# Altium schematic sheet USB_UART.schdoc
size 223 x 199 mm
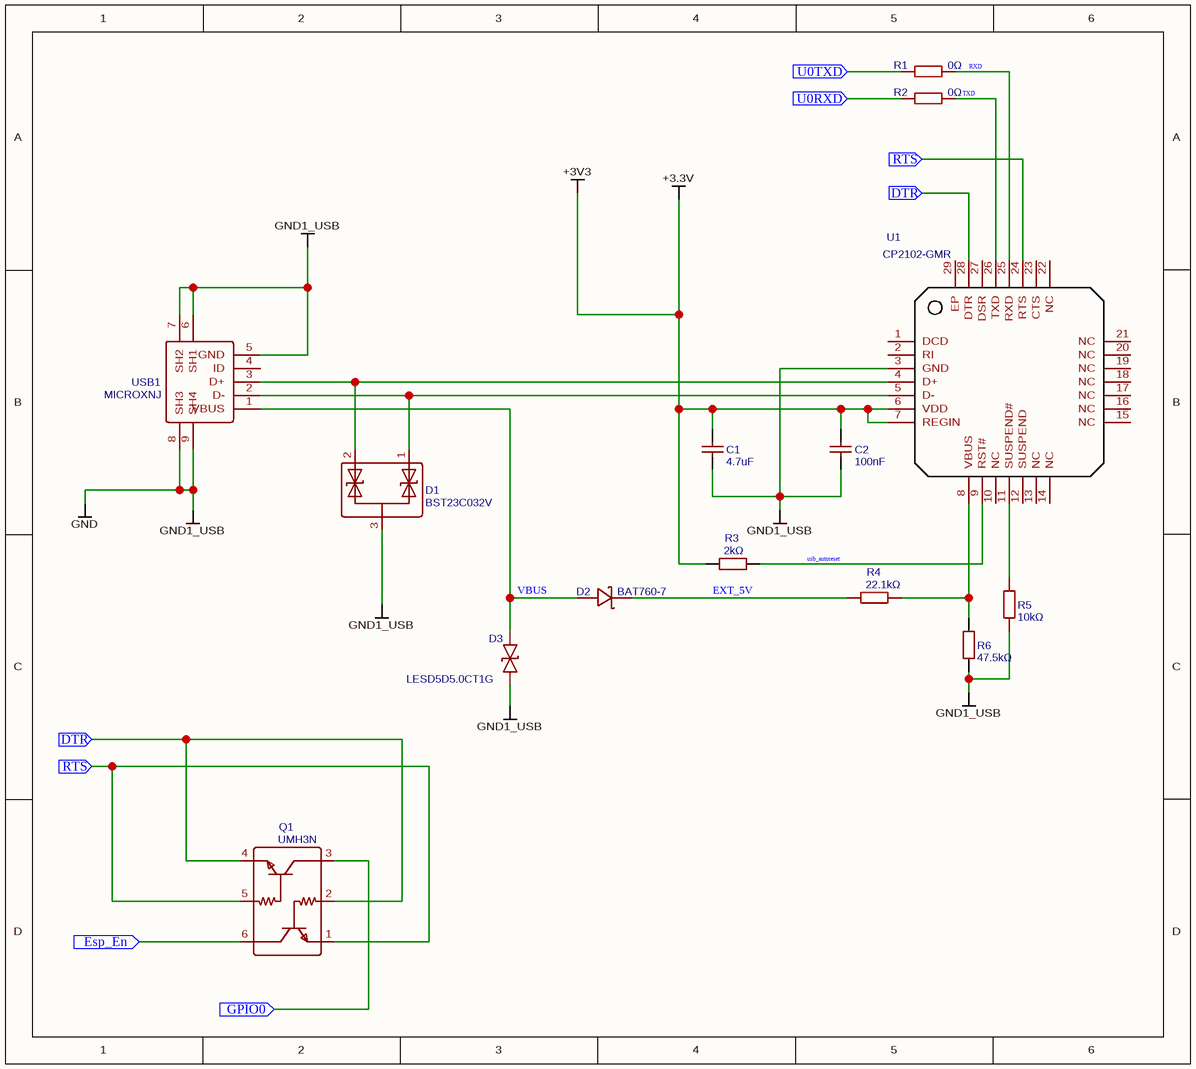
[diagram p0: USB_UART.schdoc]

## Parts
C1  4.7uF  [C0603]
C2  100nF  [C0603]
D1  BST23C032V  [SOT-23_L2.9-W1.3-P1.90-LS2.4-BR]
D2  BAT760-7  [SOD-323_L1.8-W1.3-LS2.5-RD]
D3  LESD5D5.0CT1G  [SOD-523_L1.2-W0.8-LS1.6-BI]
Q1  UMH3N  [SC-70-6_L2.2-W1.3-P0.65-LS2.1-BR]
R1  0Ω  [R0603]
R2  0Ω  [R0603]
R3  2kΩ  [R0603]
R4  22.1kΩ  [R0603]
R5  10kΩ  [R0603]
R6  47.5kΩ  [R0603]
U1  CP2102-GMR  [QFN-28_L5.0-W5.0-P0.50-BL-EP]
USB1  MICROXNJ  [MICRO-USB-SMD_MICROXNJ]

## Ports
DTR (in), Esp_En (in), GPIO0 (in), RTS (in), U0RXD (in), U0TXD (in)

## Nets
+3.3V: C1.2 C2.2 R3.1 U1.6(VDD) U1.7(REGIN)  [also labelled +3V3]
GND: C1.1 C2.1 D1.3 D3.1 R5.1 R6.1 U1.3(GND) USB1.5(GND) USB1.6(SH1) USB1.7(SH2) USB1.8(SH3) USB1.9(SH4)  [also labelled GND1_USB]
DTR: Q1.2(B) Q1.4(E) U1.28(DTR) ; port DTR
Esp_En: Q1.6(C) ; port Esp_En
EXT_5V: D2.1 R4.1
GPIO0: Q1.3(C) ; port GPIO0
RTS: Q1.1(E) Q1.5(B) U1.24(RTS) ; port RTS
RXD: R1.2 U1.25(RXD)
TXD: R2.2 U1.26(TXD)
U0RXD: R2.1 ; port U0RXD
U0TXD: R1.1 ; port U0TXD
usb_autoreset: R3.2 U1.9(RST#)
VBUS: D2.2 D3.2 USB1.1(VBUS)
NetD1_1: D1.1 U1.5(D-) USB1.2(D-)
NetD1_2: D1.2 U1.4(D+) USB1.3(D+)
NetR4_2: R4.2 R6.2 U1.8(VBUS)
NetR5_2: R5.2 U1.11(SUSPEND#)

Not connected (* = marked no-connect by the designer): U1 1(DCD) 2(RI) 10(NC) 12(SUSPEND) 13(NC) 14(NC) 15(NC) 16(NC) 17(NC) 18(NC) 19(NC) 20(NC) 21(NC) 22(NC) 23(CTS) 27(DSR) 29(EP); USB1 4(ID)

## Library data of the parts
C1 = 4.7uF: BOM_Manufacturer: FH; BOM_Manufacturer Part: 0603X475K160NT; nameAlias: Capacitance; BOM_Supplier: LCSC; BOM_Supplier Part: C99229; BOM_JLCPCB Part Class: Extended Part; spicePre: C; spiceSymbolName: 0603X475K160NT
C2 = 100nF: BOM_Manufacturer: SAMSUNG; BOM_Manufacturer Part: CL10B104KO8NNNC; nameAlias: Capacitance; BOM_Supplier: LCSC; BOM_Supplier Part: C66501; BOM_JLCPCB Part Class: Extended Part; spicePre: C; spiceSymbolName: CL10B104KO8NNNC
D1 = BST23C032V: BOM_Manufacturer: Bourne Semicon (Shenzhen); Contributor: LCSC; BOM_Supplier: LCSC; BOM_Supplier Part: C151968; BOM_Manufacturer Part: BST23C032V; BOM_JLCPCB Part Class: Extended Part; spicePre: D; spiceSymbolName: BST23C032V
D2 = BAT760-7: BOM_Manufacturer: DIODES; Contributor: LCSC; BOM_Supplier: LCSC; BOM_Manufacturer Part: BAT760-7; BOM_Supplier Part: C124187; BOM_JLCPCB Part Class: Extended Part; spicePre: D; spiceSymbolName: BAT760-7
D3 = LESD5D5.0CT1G: BOM_Manufacturer: Leshan Radio; Contributor: LCSC; BOM_Supplier: LCSC; BOM_Supplier Part: C383211; BOM_Manufacturer Part: LESD5D5.0CT1G; BOM_JLCPCB Part Class: Extended Part; spicePre: D; spiceSymbolName: LESD5D5.0CT1G
Q1 = UMH3N: BOM_Manufacturer: CJ; BOM_Supplier: LCSC; BOM_Manufacturer Part: UMH3N; BOM_Supplier Part: C62892; BOM_JLCPCB Part Class: Extended Part; spicePre: Q; spiceSymbolName: UMH3N
R1 R2 = 0Ω: BOM_Manufacturer: FH; BOM_Manufacturer Part: RS-03000FT; Resistance (Ohms): 0; nameAlias: Resistance; Contributor: LCSC; BOM_Supplier: LCSC; BOM_Supplier Part: C136582; BOM_JLCPCB Part Class: Extended Part; spicePre: R; spiceSymbolName: RS-03000FT
R3 = 2kΩ: BOM_Manufacturer: FH; BOM_Manufacturer Part: RS-03K2001FT; nameAlias: Resistance; Resistance (Ohms): 2K; BOM_Supplier: LCSC; BOM_Supplier Part: C115336; BOM_JLCPCB Part Class: Extended Part; spicePre: R; spiceSymbolName: RS-03K2001FT
R4 = 22.1kΩ: BOM_Manufacturer: Guangdong Fenghua Advanced Tech; BOM_Manufacturer Part: RS-03K2212FT; Resistance (Ohms): 22.1K; nameAlias: Resistance; Contributor: LCSC; BOM_Supplier: LCSC; BOM_Supplier Part: C310274; BOM_JLCPCB Part Class: Extended Part; spicePre: R; spiceSymbolName: RS-03K2212FT
R5 = 10kΩ: BOM_Manufacturer: Guangdong Fenghua Advanced Tech; BOM_Manufacturer Part: RS-03K1002FT; Resistance (Ohms): 10K; nameAlias: Resistance; Contributor: LCSC; BOM_Supplier: LCSC; BOM_Supplier Part: C115324; BOM_JLCPCB Part Class: Extended Part; spicePre: R; spiceSymbolName: RS-03K1002FT
R6 = 47.5kΩ: BOM_Manufacturer: UniOhm; BOM_Manufacturer Part: 0603WAF4752T5E; nameAlias: Resistance; Resistance (Ohms): 47.5K; BOM_Supplier: LCSC; BOM_Supplier Part: C23061; BOM_JLCPCB Part Class: Extended Part; spicePre: R; spiceSymbolName: 0603WAF4752T5E
U1 = CP2102-GMR: BOM_Manufacturer: SILICON LABS; BOM_Supplier: LCSC; BOM_Manufacturer Part: CP2102-GMR; BOM_Supplier Part: C6568; BOM_JLCPCB Part Class: Basic Part; spicePre: U; spiceSymbolName: CP2102-GMR
USB1 = MICROXNJ: BOM_Manufacturer: SHOU HAN; Contributor: LCSC; BOM_Supplier: LCSC; BOM_Supplier Part: C404969; BOM_Manufacturer Part: MicroXNJ; BOM_JLCPCB Part Class: Extended Part; spicePre: U; spiceSymbolName: MICROXNJ